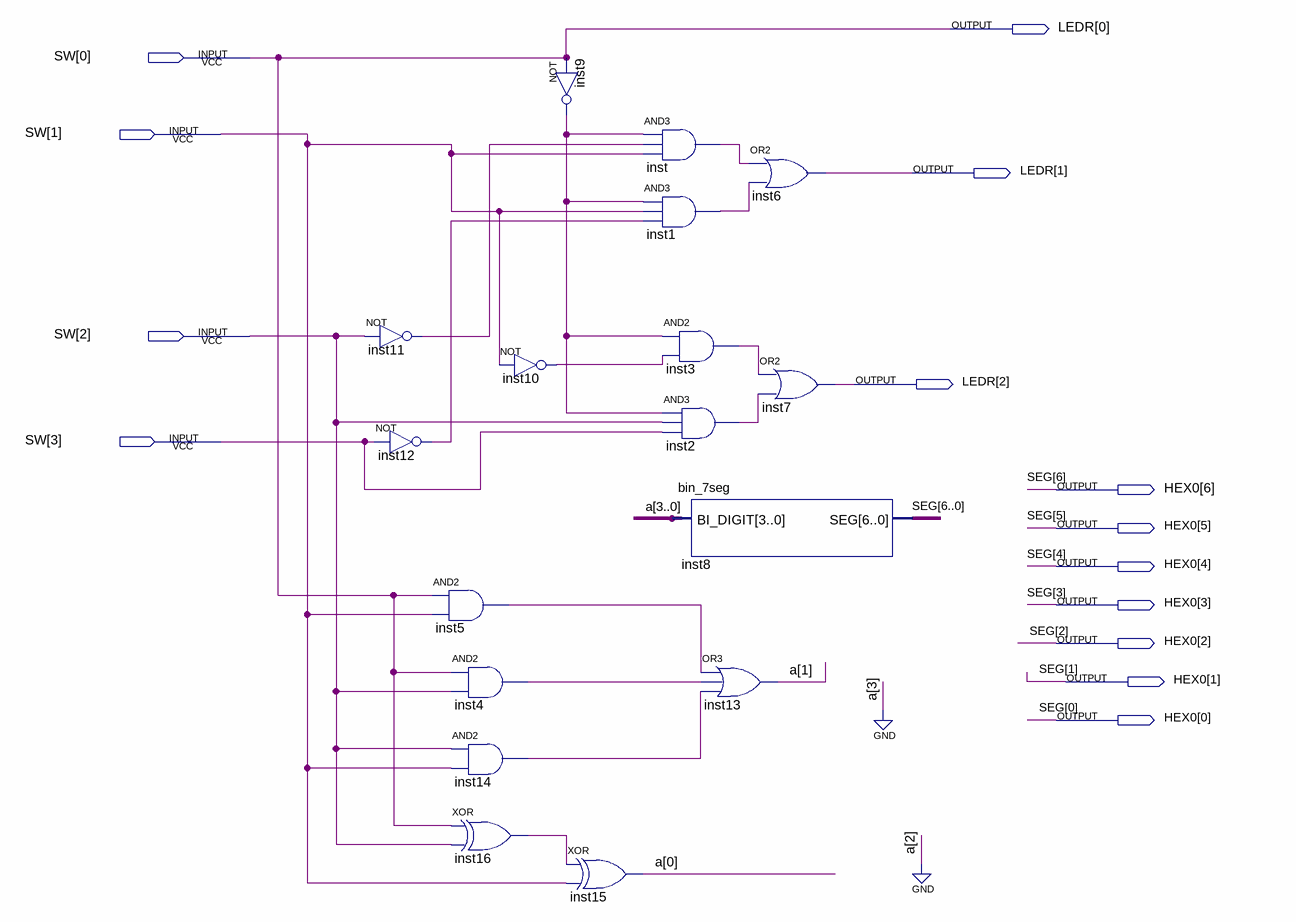
[diagram p0: schematic sheet]
// Quartus schematic Lab3.bdf as structural Verilog: 17 symbols, 14 pins
module Lab3 (
  input  [3:0] SW,
  output [2:0] LEDR,
  output [6:0] HEX0
);

  wire inst1_out, inst2_out, inst3_out, inst4_out, inst5_out, inst9_out, inst10_out, inst11_out, inst12_out,
       inst14_out, inst16_out, inst_out;
  wire [1:0] a;

  not inst11 (inst11_out, SW[2]);
  not inst12 (inst12_out, SW[3]);
  and inst5 (inst5_out, SW[0], SW[1]);
  and inst4 (inst4_out, SW[0], SW[2]);
  and inst14 (inst14_out, SW[2], SW[1]);
  xor inst16 (inst16_out, SW[0], SW[2]);
  not inst9 (inst9_out, SW[0]);
  not inst10 (inst10_out, SW[1]);
  xor inst15 (a[0], inst16_out, SW[1]);
  and inst (inst_out, inst9_out, inst11_out, SW[1]);
  and inst1 (inst1_out, inst9_out, SW[1], inst12_out);
  and inst3 (inst3_out, inst9_out, inst10_out);
  and inst2 (inst2_out, inst9_out, SW[2], SW[3]);
  bin_7seg inst8 (.BI_DIGIT({2'b00, a}), .SEG(HEX0));
  or inst13 (a[1], inst5_out, inst4_out, inst14_out);
  or inst6 (LEDR[1], inst_out, inst1_out);
  or inst7 (LEDR[2], inst3_out, inst2_out);

  assign LEDR[0] = SW[0];

  // Other names for the same wires on the sheet: SEG[6:0] = HEX0
endmodule
